# Altium project ETRX_Shield.PrjPcb (part 2 of 3)

## Sheet [2] MCU.SchDoc
size A4; DocumentNumber: 3; SheetNumber: 3; SheetTotal: 4
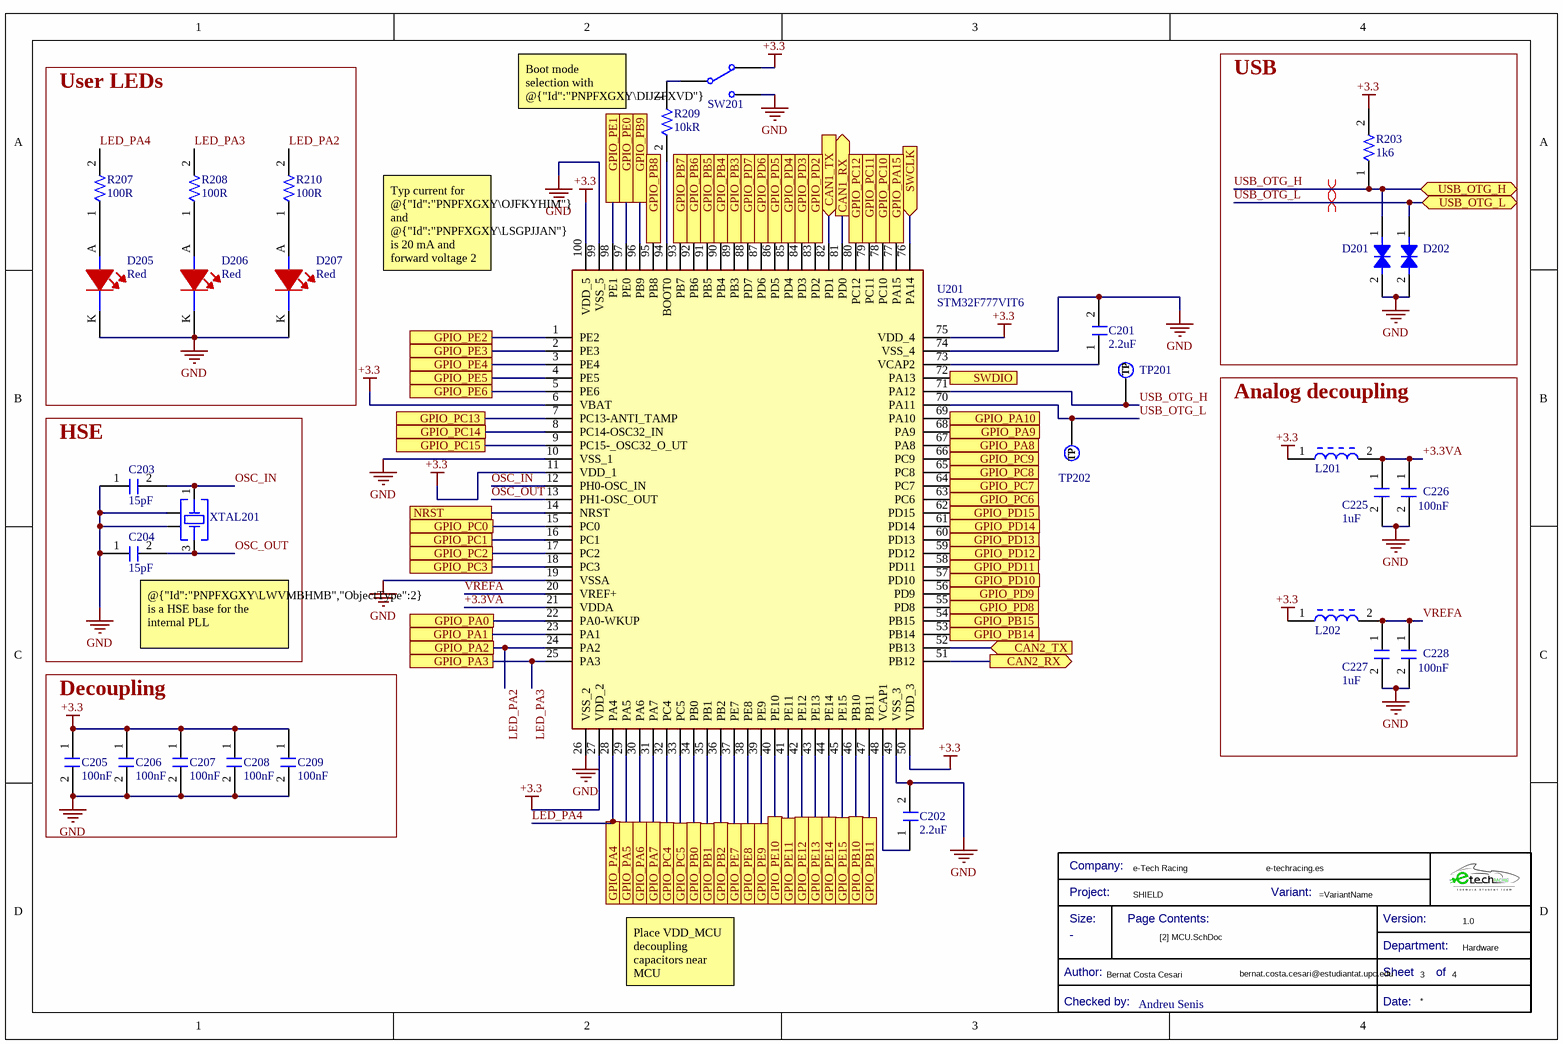
[diagram p2: [2] MCU.SchDoc]

### Parts
(Parts that share a designator on the sheet are numbered #1, #2 ... from top to bottom, then left to right.)
*?#2  Checked by:: Andreu Senis  (hidden comment: Title Block_template)  (graphical)
C201  2.2uF  [C0805FNPC-W]
C202  2.2uF  [C0805FNPC-W]
C203  Capacitance: 15pF  [C0805FNPC-R]  (hidden comment: 885012007052)
C204  Capacitance: 15pF  [C0805FNPC-R]  (hidden comment: 885012007052)
C205  Capacitance: 100nF  [C0805FNPC-R]  (hidden comment: 885012207098)
C206  Capacitance: 100nF  [C0805FNPC-R]  (hidden comment: 885012207098)
C207  Capacitance: 100nF  [C0805FNPC-R]  (hidden comment: 885012207098)
C208  Capacitance: 100nF  [C0805FNPC-R]  (hidden comment: 885012207098)
C209  Capacitance: 100nF  [C0805FNPC-R]  (hidden comment: 885012207098)
C225  Capacitance: 1uF  [C0805FNPC-R]  (hidden comment: 885012207103)
C226  Capacitance: 100nF  [C0805FNPC-R]  (hidden comment: 885012207098)
C227  Capacitance: 1uF  [C0805FNPC-R]  (hidden comment: 885012207103)
C228  Capacitance: 100nF  [C0805FNPC-R]  (hidden comment: 885012207098)
D201  824501600  [DTVS-DO-214AC]  (value not drawn)
D202  824501600  [DTVS-DO-214AC]  (value not drawn)
D205  Color: Red  [LED_0805_WE]  (hidden comment: 150080RS75000)
D206  Color: Red  [LED_0805_WE]  (hidden comment: 150080RS75000)
D207  Color: Red  [LED_0805_WE]  (hidden comment: 150080RS75000)
L201  782853561  [L_Ferrite_bead_0805]  (value not drawn)
L202  782853561  [L_Ferrite_bead_0805]  (value not drawn)
R203  Resistance: 1k6  [R1206FTK-W]  (hidden comment: CRCW12061K60FKEA)
R207  Resistance: 100R  [R0805FTK]  (hidden comment: CR0805-FX-1000ELF)
R208  Resistance: 100R  [R0805FTK]  (hidden comment: CR0805-FX-1000ELF)
R209  Resistance: 10kR  [R0805FTK]  (hidden comment: CR0805-JW-103ELF)
R210  Resistance: 100R  [R0805FTK]  (hidden comment: CR0805-FX-1000ELF)
SW201  450405020524  [450405020524]  (value not drawn)
TP201  TestPoint  [TestPoint]  (value not drawn)  (no BOM)
TP202  TestPoint  [TestPoint]  (value not drawn)  (no BOM)
U201  STM32F777VIT6  [QFP50P1600X1600X160-100N]
XTAL201  20MHz  [XTAL_CFPX-104_5_3.2]  (value not drawn)

### Blocks framed on the sheet
User LEDs: D205-D207 R207 R208 R210
USB: D201 D202 R203
HSE: C203 C204 XTAL201
Analog decoupling: C225-C228 L201 L202
Decoupling: C205-C209

### Ports
CAN1_RX (out), CAN1_TX (in), CAN2_RX (out), CAN2_TX (in), GPIO_PA0, GPIO_PA1, GPIO_PA2, GPIO_PA3, GPIO_PA4, GPIO_PA5, GPIO_PA6, GPIO_PA7, GPIO_PA8, GPIO_PA9, GPIO_PA10, GPIO_PA15, GPIO_PB0, GPIO_PB1, GPIO_PB2, GPIO_PB3, GPIO_PB4, GPIO_PB5, GPIO_PB6, GPIO_PB7, GPIO_PB8, GPIO_PB9, GPIO_PB10, GPIO_PB11, GPIO_PB14, GPIO_PB15, GPIO_PC0, GPIO_PC1, GPIO_PC2, GPIO_PC3, GPIO_PC4, GPIO_PC5, GPIO_PC6, GPIO_PC7, GPIO_PC8, GPIO_PC9, GPIO_PC10, GPIO_PC11, GPIO_PC12, GPIO_PC13, GPIO_PC14, GPIO_PC15, GPIO_PD2, GPIO_PD3, GPIO_PD4, GPIO_PD5, GPIO_PD6, GPIO_PD7, GPIO_PD8, GPIO_PD9, GPIO_PD10, GPIO_PD11, GPIO_PD12, GPIO_PD13, GPIO_PD14, GPIO_PD15, GPIO_PE0, GPIO_PE1, GPIO_PE2, GPIO_PE3, GPIO_PE4, GPIO_PE5, GPIO_PE6, GPIO_PE7, GPIO_PE8, GPIO_PE9, GPIO_PE10, GPIO_PE11, GPIO_PE12, GPIO_PE13, GPIO_PE14, GPIO_PE15, NRST, SWCLK (in), SWDIO (in), USB_OTG_H (bidir), USB_OTG_L (bidir)

### Nets
+3.3: C205.1 C206.1 C207.1 C208.1 C209.1 L201.1 L202.1 R203.2 SW201.L1 U201.6(VBAT) U201.11(VDD_1) U201.27(VDD_2) U201.50(VDD_3) U201.75(VDD_4) U201.100(VDD_5)
GND: C201.2 C202.2 C203.1 C204.1 C205.2 C206.2 C207.2 C208.2 C209.2 C225.2 C226.2 C227.2 C228.2 D201.2 D202.2 D205.K D206.K D207.K SW201.L2 U201.10(VSS_1) U201.19(VSSA) U201.26(VSS_2) U201.49(VSS_3) U201.74(VSS_4) U201.99(VSS_5) XTAL201.2(GND_&_Lid) XTAL201.4(GND_&_Lid)
+3.3VA: C225.1 C226.1 L201.2 U201.21(VDDA)
CAN1_RX: U201.81(PD0) ; port CAN1_RX
CAN1_TX: U201.82(PD1) ; port CAN1_TX
CAN2_RX: U201.51(PB12) ; port CAN2_RX
CAN2_TX: U201.52(PB13) ; port CAN2_TX
LED_PA2: R210.2 U201.24(PA2) ; port GPIO_PA2
LED_PA3: R208.2 U201.25(PA3) ; port GPIO_PA3
LED_PA4: R207.2 U201.28(PA4) ; port GPIO_PA4
NRST: U201.14(NRST) ; port NRST
OSC_IN: C203.2 U201.12(PH0-OSC_IN) XTAL201.1(Crystal)
OSC_OUT: C204.2 U201.13(PH1-OSC_OUT) XTAL201.3(Crystal)
PA0: U201.22(PA0-WKUP) ; port GPIO_PA0
PA1: U201.23(PA1) ; port GPIO_PA1
PA5: U201.29(PA5) ; port GPIO_PA5
PA6: U201.30(PA6) ; port GPIO_PA6
PA7: U201.31(PA7) ; port GPIO_PA7
PA8: U201.67(PA8) ; port GPIO_PA8
PA9: U201.68(PA9) ; port GPIO_PA9
PA10: U201.69(PA10) ; port GPIO_PA10
PA15: U201.77(PA15) ; port GPIO_PA15
PB0: U201.34(PB0) ; port GPIO_PB0
PB1: U201.35(PB1) ; port GPIO_PB1
PB2: U201.36(PB2) ; port GPIO_PB2
PB3: U201.89(PB3) ; port GPIO_PB3
PB4: U201.90(PB4) ; port GPIO_PB4
PB5: U201.91(PB5) ; port GPIO_PB5
PB6: U201.92(PB6) ; port GPIO_PB6
PB7: U201.93(PB7) ; port GPIO_PB7
PB8: U201.95(PB8) ; port GPIO_PB8
PB9: U201.96(PB9) ; port GPIO_PB9
PB10: U201.46(PB10) ; port GPIO_PB10
PB11: U201.47(PB11) ; port GPIO_PB11
PB14: U201.53(PB14) ; port GPIO_PB14
PB15: U201.54(PB15) ; port GPIO_PB15
PC0: U201.15(PC0) ; port GPIO_PC0
PC1: U201.16(PC1) ; port GPIO_PC1
PC2: U201.17(PC2) ; port GPIO_PC2
PC3: U201.18(PC3) ; port GPIO_PC3
PC4: U201.32(PC4) ; port GPIO_PC4
PC5: U201.33(PC5) ; port GPIO_PC5
PC6: U201.63(PC6) ; port GPIO_PC6
PC7: U201.64(PC7) ; port GPIO_PC7
PC8: U201.65(PC8) ; port GPIO_PC8
PC9: U201.66(PC9) ; port GPIO_PC9
PC10: U201.78(PC10) ; port GPIO_PC10
PC11: U201.79(PC11) ; port GPIO_PC11
PC12: U201.80(PC12) ; port GPIO_PC12
PC13: U201.7(PC13-ANTI_TAMP) ; port GPIO_PC13
PC14: U201.8(PC14-OSC32_IN) ; port GPIO_PC14
PC15: U201.9(PC15-_OSC32_O_UT) ; port GPIO_PC15
PD2: U201.83(PD2) ; port GPIO_PD2
PD3: U201.84(PD3) ; port GPIO_PD3
PD4: U201.85(PD4) ; port GPIO_PD4
PD5: U201.86(PD5) ; port GPIO_PD5
PD6: U201.87(PD6) ; port GPIO_PD6
PD7: U201.88(PD7) ; port GPIO_PD7
PD8: U201.55(PD8) ; port GPIO_PD8
PD9: U201.56(PD9) ; port GPIO_PD9
PD10: U201.57(PD10) ; port GPIO_PD10
PD11: U201.58(PD11) ; port GPIO_PD11
PD12: U201.59(PD12) ; port GPIO_PD12
PD13: U201.60(PD13) ; port GPIO_PD13
PD14: U201.61(PD14) ; port GPIO_PD14
PD15: U201.62(PD15) ; port GPIO_PD15
PE0: U201.97(PE0) ; port GPIO_PE0
PE1: U201.98(PE1) ; port GPIO_PE1
PE2: U201.1(PE2) ; port GPIO_PE2
PE3: U201.2(PE3) ; port GPIO_PE3
PE4: U201.3(PE4) ; port GPIO_PE4
PE5: U201.4(PE5) ; port GPIO_PE5
PE6: U201.5(PE6) ; port GPIO_PE6
PE7: U201.37(PE7) ; port GPIO_PE7
PE8: U201.38(PE8) ; port GPIO_PE8
PE9: U201.39(PE9) ; port GPIO_PE9
PE10: U201.40(PE10) ; port GPIO_PE10
PE11: U201.41(PE11) ; port GPIO_PE11
PE12: U201.42(PE12) ; port GPIO_PE12
PE13: U201.43(PE13) ; port GPIO_PE13
PE14: U201.44(PE14) ; port GPIO_PE14
PE15: U201.45(PE15) ; port GPIO_PE15
SWCLK: U201.76(PA14) ; port SWCLK
SWDIO: U201.72(PA13) ; port SWDIO
USB_OTG_H: D201.1 R203.1 TP201.1(TP) U201.71(PA12) ; port USB_OTG_H
USB_OTG_L: D202.1 TP202.1(TP) U201.70(PA11) ; port USB_OTG_L
VREFA: C227.1 C228.1 L202.2 U201.20(VREF+)
NetC201_1: C201.1 U201.73(VCAP2)
NetC202_1: C202.1 U201.48(VCAP1)
NetD205_A: D205.A R207.1
NetD206_A: D206.A R208.1
NetD207_A: D207.A R210.1
NetR209_1: R209.1 SW201.COM
NetR209_2: R209.2 U201.94(BOOT0)

### Layout directives
differential pair: USB_OTG_H, USB_OTG_L

### Notes on the sheet
- (near R209) Boot mode selection with @{"Id":"PNPFXGXY\DIJZFXVD"}
- Typ current for @{"Id":"PNPFXGXY\OJFKYHIM"} and @{"Id":"PNPFXGXY\LSGPJJAN"} is 20 mA and forward voltage 2 V. R=(3,3-2)/20m
- @{"Id":"PNPFXGXY\LWVMBHMB","ObjectType":2} is a HSE base for the internal PLL
- Place VDD_MCU decoupling capacitors near MCU
- (in symbol Title Block_template) Company:; Project:; Variant:; Size:; Page Contents:; Version:; Department:; Author:; Sheet; of; Checked by:; Date:

### Library data of the parts
*?#2 = Title Block_template: Standard Title Block; .Creator: GP; Category: Title Block; .PCBcheck: GP; .SCHcheck: GP; Size: -
C201 C202 = C2.2u-16V-0805FTK
C203 C204 = C15p-50V-0805FNPC-NP0: Cap, 15PF, 50V, 5%, C0G/NP0, 0805; Manufacturer 1: Wurth Electronics; .Creator: DR; Supplier 1: Newark; Manufacturer Part Number 1: 885012007052; RoHS: Yes; Category: Ceramic Capacitors; Stock 1: 815; Pricing 1: 1=0,10800, 10=0,05200, 25=0,05100, 50=0,04900, 100=0,04800, 250=0,04600, 500=0,04300 (USD); Mount: Surface Mount; Case/Package: 0805; Case Code (Metric): 2012; Case Code (Imperial): 0805; Min Operating Temperature: -55°C; Max Operating Temperature: 125°C; Packaging: Cut Tape; Voltage Rating: 50V; Tolerance: 5%; Length: 0.079inch; Width: 0.049inch; Thickness: 0.028inch; RoHS Compliant: Yes; ComponentLink1URL: http://www.farnell.com/datasheets/2031702.pdf?src-supplier=Farnell; ComponentLink1Description: http://www.farnell.com/datasheets/2031702.pdf?src-supplier=Farnell; ComponentLink2URL: http://katalog.we-online.de/pbs/datasheet/885012007052.pdf?src-supplier=Digi-Key; ComponentLink2Description: http://katalog.we-online.de/pbs/datasheet/885012007052.pdf?src-supplier=Digi-Key; ComponentLink3URL: https://katalog.we-online.de/pbs/datasheet/885012007052.pdf?src-supplier=Digi-Key; ComponentLink3Description: https://katalog.we-online.de/pbs/datasheet/885012007052.pdf?src-supplier=Digi-Key; Supplier Part Number 1: 15AC9316
C205-C209 C226 C228 = C100n-50V-0805FNPC-X7R: Cap, 0.1ΜF, 50V, 10%, X7R, 0805; Manufacturer 1: Wurth Electronics; .Creator: DR; Supplier 1: RSComponents; Manufacturer Part Number 1: 885012207098; RoHS: Yes; Category: Ceramic Capacitors; Stock 1: 8000; Pricing 1: 100=0,10200, 500=0,07100, 2000=0,06100 (GBP); Mount: Surface Mount; Case/Package: 0805; Case Code (Metric): 2012; Case Code (Imperial): 0805; Min Operating Temperature: -55°C; Max Operating Temperature: 125°C; Packaging: Cut Tape; Voltage Rating: 50V; Dielectric: X7R; Tolerance: 10%; Voltage Rating (DC): 50V; Length: 0.079inch; Width: 0.049inch; Thickness: 0.035inch; REACH SVHC: Unknown; RoHS Compliant: Yes; ComponentLink1URL: http://www.farnell.com/datasheets/1958498.pdf?src-supplier=Farnell; ComponentLink1Description: http://www.farnell.com/datasheets/1958498.pdf?src-supplier=Farnell; ComponentLink2URL: http://www.farnell.com/datasheets/1958498.pdf?src-supplier=Element14; ComponentLink2Description: http://www.farnell.com/datasheets/1958498.pdf?src-supplier=Element14; ComponentLink3URL: https://katalog.we-online.de/pbs/datasheet/885012207098.pdf?src-supplier=Digi-Key; ComponentLink3Description: https://katalog.we-online.de/pbs/datasheet/885012207098.pdf?src-supplier=Digi-Key; ComponentLink4URL: http://www.farnell.com/datasheets/1958498.pdf?src-supplier=Newark; ComponentLink4Description: http://www.farnell.com/datasheets/1958498.pdf?src-supplier=Newark; Supplier Part Number 1: 1813493
C225 C227 = C1u-50V-0805FNPC-X7R: Multilayer Ceramic Capacitor, Wcap-Csgp Series, 1 F, 10%, X7R, 50 V, 0805 [2012 Metric] Rohs Compliant: Yes; Manufacturer 1: Wurth Electronics; Voltage Rating: 50V; .Creator: GP; Supplier 1: RSComponents; Manufacturer Part Number 1: 885012207103; RoHS: Yes; Category: Ceramic Capacitors; Stock 1: 5100; Pricing 1: 50=0,27200, 250=0,25300, 500=0,22800, 1250=0,20100, 2500=0,17100 (GBP); Mount: Surface Mount; Case/Package: 0805; Case Code (Metric): 2012; Case Code (Imperial): 0805; Min Operating Temperature: -55°C; Max Operating Temperature: 85°C; Packaging: Cut Tape; Dielectric: X7R; Tolerance: 10%; Voltage Rating (DC): 50V; Length: 0.079inch; Width: 0.049inch; Thickness: 0.053inch; REACH SVHC: Unknown; RoHS Compliant: Yes; ComponentLink1URL: http://www.farnell.com/datasheets/1958501.pdf?src-supplier=Farnell; ComponentLink1Description: http://www.farnell.com/datasheets/1958501.pdf?src-supplier=Farnell; ComponentLink2URL: http://www.farnell.com/datasheets/1958501.pdf?src-supplier=Element14; ComponentLink2Description: http://www.farnell.com/datasheets/1958501.pdf?src-supplier=Element14; ComponentLink3URL: https://katalog.we-online.de/pbs/datasheet/885012107003.pdf?src-supplier=Digi-Key; ComponentLink3Description: https://katalog.we-online.de/pbs/datasheet/885012107003.pdf?src-supplier=Digi-Key; ComponentLink4URL: http://www.farnell.com/datasheets/1958501.pdf?src-supplier=Newark; ComponentLink4Description: http://www.farnell.com/datasheets/1958501.pdf?src-supplier=Newark; Supplier Part Number 1: 1813523
D201 D202 = DTVS-6V-DO-214AC: TVS diode [Würth Elektronik] 824501600 TVS diode; Manufacturer: Wurth Electronics; Number of Bidirectional Channels: 1; Reverse Standoff Voltage: 6V; Min Breakdown Voltage: 7.02V; Clamping Voltage: 10.3V; Peak Pulse Power: 400W; Power Line Protection: No; Polarity: Bidirectional; Peak Pulse Current: 38.8A; .Creator: DO; ComponentLink1Description: Where buy it; ComponentLink1URL: https://www.we-online.com/catalog/en/WE-TVSP?sq=824501600#824501600; Supplier 1: Mouser; Manufacturer Part Number: 824501600; RoHS: Yes; Category: TVS Diodes; Stock 1: 780; Pricing 1: 1=0,28000, 10=0,26100, 50=0,26100, 100=0,23400, 500=0,20400, 1000=0,17400, 10000=0,17400 (USD); Mount: Surface Mount; Number of Pins: 2; Min Operating Temperature: -65°C; Max Operating Temperature: 150°C; Packaging: Cut Tape; Max Breakdown Voltage: 7.02V; Resistor Type: Zener; REACH SVHC: Unknown; RoHS Compliant: Yes; ComponentLink2URL: http://www.farnell.com/datasheets/2036401.pdf?src-supplier=Element14; ComponentLink2Description: http://www.farnell.com/datasheets/2036401.pdf?src-supplier=Element14; Supplier Part Number 1: 710-824501600; ComponentLink3URL: https://katalog.we-online.de/pbs/datasheet/824501600.pdf?src-supplier=Digi-Key; ComponentLink3Description: https://katalog.we-online.de/pbs/datasheet/824501600.pdf?src-supplier=Digi-Key
D205-D207 = LEDRS-0805-150: 0805(H=0.8mm) 红色 高亮 λD=625nm VF=2V IF=30mA PD=72mW; Manufacturer 1: Wurth Electronics; Luminous Intensity: 150mcd; Viewing Angle: 140°; Forward Voltage: 2V; Wavelength: 625nm; Lens Style: Clear,Rectangular; Forward Current: 30mA; Test Current: 20mA; .Creator: DR; ComponentLink1Description: Datasheet; ComponentLink1URL: https://www.we-online.com/catalog/datasheet/150080RS75000.pdf; ComponentLink2Description: Where buy it; ComponentLink2URL: https://katalog.we-online.de/en/led/WL-SMCW/150080RS75000; Supplier 1: RSComponents; Manufacturer Part Number 1: 150080RS75000; RoHS: Yes; Category: LEDs; Stock 1: 1; Pricing 1: 50=0,19300, 500=0,12900, 1000=0,12300, 2000=0,11700, 4000=0,11100 (USD); Mount: Surface Mount; Case/Package: 0805; Case Code (Metric): 2012; Case Code (Imperial): 0805; Min Operating Temperature: -40°C; Max Operating Temperature: 85°C; Package Quantity: 4000; Packaging: Tape and Reel; Dominant Wavelength: 625nm; Length: 2mm; Width: 1.25mm; Height: 0.7mm; REACH SVHC: Unknown; RoHS Compliant: Yes; ComponentLink3URL: https://datasheet.ciiva.com/22656/150080rs75000-22656961.pdf?src-supplier=Element14; ComponentLink3Description: https://datasheet.ciiva.com/22656/150080rs75000-22656961.pdf?src-supplier=Element14; ComponentLink4URL: https://datasheet.ciiva.com/29279/759435-da-01-en-chipled-0805-w-kl-rot-150080rs75000-29279032.pdf?src-supplier=Conrad; ComponentLink4Description: https://datasheet.ciiva.com/29279/759435-da-01-en-chipled-0805-w-kl-rot-150080rs75000-29279032.pdf?src-supplier=Conrad; Supplier Part Number 1: 8154225P
L201 L202 = L_Ferrite_bead_782853561: Manufacturer: Murata; Manufacturer Part Number: BLM18EG331TN1D; Material: Ferrite,Steel; Impedance: 330R; DC Resistance (DCR): 210mR; Tolerance: 25%; Current Rating: 500mA; Number of Lines: 1; Test Frequency: 100MHz; .Creator: GP; Supplier 1: Digi-Key; RoHS: Yes; Category: Ferrite Beads and Chips; Stock 1: 20037; Pricing 1: 1=0,23000, 10=0,17500, 25=0,14520, 50=0,12520, 100=0,11260, 250=0,09508, 500=0,08508, 1000=0,07257 (USD); Case/Package: 0603; Number of Pins: 2; Core Material: Ferrite; Case Code (Metric): 1608; Case Code (Imperial): 0603; Min Operating Temperature: -55°C; Max Operating Temperature: 125°C; Packaging: Tape and Reel; Max DC Current: 500mA; Number of Circuits: 1; Package Quantity: 1; Max Current Rating: 500mA; Termination: SMD/SMT; Series: BLM18E; Resistance: 210mR; Length: 1.6mm; Width: 0.8mm; Height: 0.8mm; Depth: 0.8mm; REACH SVHC: No SVHC; Lead Free: Lead Free; RoHS Compliant: Yes; ComponentLink1URL: https://datasheet.ciiva.com/1467/5169-1467232.pdf?src-supplier=Element14; ComponentLink1Description: https://datasheet.ciiva.com/1467/5169-1467232.pdf?src-supplier=Element14; ComponentLink2URL: https://datasheet.ciiva.com/11795/0900766b811b5866-11795405.pdf?src-supplier=RSComponents; ComponentLink2Description: https://datasheet.ciiva.com/11795/0900766b811b5866-11795405.pdf?src-supplier=RSComponents; ComponentLink3URL: https://datasheet.ciiva.com/41449/001172267-da-01-en-drossel-0603-330r-1-6x0-8mm-4000st-41449581.pdf?src-supplier=Conrad; ComponentLink3Description: https://datasheet.ciiva.com/41449/001172267-da-01-en-drossel-0603-330r-1-6x0-8mm-4000st-41449581.pdf?src-supplier=Conrad; ComponentLink4URL: https://datasheet.ciiva.com/1467/5169-1467233.pdf?src-supplier=Element14; ComponentLink4Description: https://datasheet.ciiva.com/1467/5169-1467233.pdf?src-supplier=Element14; ComponentLink5URL: https://datasheet.ciiva.com/1561/5169-1561345.pdf?src-supplier=Newark; ComponentLink5Description: https://datasheet.ciiva.com/1561/5169-1561345.pdf?src-supplier=Newark; ComponentLink6URL: https://datasheet.ciiva.com/3082/l0110s0101blm18e-3082714.pdf?src-supplier=Avnet; ComponentLink6Description: https://datasheet.ciiva.com/3082/l0110s0101blm18e-3082714.pdf?src-supplier=Avnet; ComponentLink7URL: https://datasheet.ciiva.com/6211/l0110s0101blm18e-6211470.pdf?src-supplier=Digi-Key; ComponentLink7Description: https://datasheet.ciiva.com/6211/l0110s0101blm18e-6211470.pdf?src-supplier=Digi-Key; ComponentLink8URL: https://datasheet.ciiva.com/6211/l0110s0101blm18e-6211471.pdf?src-supplier=Digi-Key; ComponentLink8Description: https://datasheet.ciiva.com/6211/l0110s0101blm18e-6211471.pdf?src-supplier=Digi-Key; Supplier Part Number 1: 490-5913-1-ND
R203 = R1.6K-1206FTK: Res Thick Film 1206 1.6K Ohm 1% 1/4W ±100ppm/°C Molded SMD SMD Paper T/R; Manufacturer 1: Vishay; Max Power Dissipation: 250mW; Voltage Rating: 200V; .Creator: DO; Supplier 1: Digi-Key; Manufacturer Part Number 1: CRCW12061K60FKEA; RoHS: Yes; Category: Chip SMD Resistors; Pricing 1: 1=0,10000, 10=0,08200, 100=0,03160, 1000=0,01392, 2500=0,01202 (USD); Case/Package: 1206; Number of Pins: 2; Contact Plating: Tin; Case Code (Metric): 3216; Case Code (Imperial): 1206; Weight: 0.000353oz; Size Code: 1206; Min Operating Temperature: -55°C; Max Operating Temperature: 155°C; Tolerance: 1%; Resistor Type: Thick Film; Temperature Coefficient: 100ppm/°C; Package Quantity: 5000; Packaging: Tape and Reel; Number of Terminations: 2; Features: Automotive AEC-Q200; Series: CRCW; Power Rating: 250mW; Termination: SMD/SMT; Voltage Rating (DC): 200V; Resistance Tolerance: 1%; Technology: THICK FILM; Construction: Rectangular; Length: 3.2mm; Width: 0.063inch; Height: 0.55mm; Depth: 1.6mm; Radiation Hardening: No; Lead Free: Lead Free; RoHS Compliant: Yes; REACH SVHC: Unknown; Military Standard: Not; ComponentLink1URL: https://datasheet.ciiva.com/11811/0900766b80d98b5e-11811377.pdf?src-supplier=RSComponents; ComponentLink1Description: https://datasheet.ciiva.com/11811/0900766b80d98b5e-11811377.pdf?src-supplier=RSComponents; ComponentLink2URL: https://datasheet.ciiva.com/2515/dcrcwe3-2515616.pdf?src-supplier=Digi-Key; ComponentLink2Description: https://datasheet.ciiva.com/2515/dcrcwe3-2515616.pdf?src-supplier=Digi-Key; ComponentLink3URL: https://datasheet.ciiva.com/2515/dcrcwe3-2515617.pdf?src-supplier=Digi-Key; ComponentLink3Description: https://datasheet.ciiva.com/2515/dcrcwe3-2515617.pdf?src-supplier=Digi-Key; ComponentLink4URL: https://datasheet.ciiva.com/2515/dcrcwe3-2515618.pdf?src-supplier=Digi-Key; ComponentLink4Description: https://datasheet.ciiva.com/2515/dcrcwe3-2515618.pdf?src-supplier=Digi-Key; ComponentLink5URL: https://datasheet.ciiva.com/9098/dcrcwe3-9098889.pdf?src-supplier=Avnet; ComponentLink5Description: https://datasheet.ciiva.com/9098/dcrcwe3-9098889.pdf?src-supplier=Avnet; ComponentLink6URL: https://datasheet.ciiva.com/16213/dcrcwe3-16213498.pdf?src-supplier=Future+Electronics; ComponentLink6Description: https://datasheet.ciiva.com/16213/dcrcwe3-16213498.pdf?src-supplier=Future+Electronics; ComponentLink7URL: https://datasheet.ciiva.com/17203/dcrcwe3-17203786.pdf?src-supplier=Avnet+Europe; ComponentLink7Description: https://datasheet.ciiva.com/17203/dcrcwe3-17203786.pdf?src-supplier=Avnet+Europe; ComponentLink8URL: https://datasheet.ciiva.com/7670/1697337-7670316.pdf?src-supplier=Element14; ComponentLink8Description: https://datasheet.ciiva.com/7670/1697337-7670316.pdf?src-supplier=Element14; ComponentLink9URL: https://datasheet.ciiva.com/7670/1697337-7670317.pdf?src-supplier=Element14; ComponentLink9Description: https://datasheet.ciiva.com/7670/1697337-7670317.pdf?src-supplier=Element14; ComponentLink10URL: https://datasheet.ciiva.com/5550/dcrcwe3-109170-5550718.pdf?src-supplier=Mouser; ComponentLink10Description: https://datasheet.ciiva.com/5550/dcrcwe3-109170-5550718.pdf?src-supplier=Mouser; Supplier Part Number 1: 541-1.60KFCT-ND; ComponentLink11Description: RS; ComponentLink11URL: https://es.rs-online.com/web/p/resistencias-fijas-para-montaje-en-superficie/6791866/
R207 R208 R210 = R100-0805FTK: Res Thick Film 0805 100 Ohm 1% 1/8W ±100ppm/°C Molded SMD SMD Paper Tape on Plastic Reel; Manufacturer 1: Bourns; Power Rating: 125mW; Voltage Rating: 150V; .Creator: DR; Supplier 1: Arrow Electronics; Manufacturer Part Number 1: CR0805-FX-1000ELF; RoHS: Yes; Category: Chip SMD Resistors; Stock 1: 49802; Pricing 1: 1=0,05840, 10=0,03430, 25=0,01780, 100=0,00750, 250=0,00560, 500=0,00490, 3000=0,00470 (USD); Mount: Surface Mount; Case/Package: 0805; Number of Pins: 2; Contact Plating: Tin; Case Code (Imperial): 0805; Case Code (Metric): 2012; Min Operating Temperature: -55°C; Max Operating Temperature: 155°C; Tolerance: 1%; Resistor Type: Thick Film; Temperature Coefficient: 100ppm/°C; Packaging: Tape and Reel; Package Quantity: 1; Termination: SMD/SMT; Number of Terminations: 2; Max Power Dissipation: 125mW; Voltage Rating (DC): 150V; Features: Moisture Resistant; Series: CR0805; Resistance Tolerance: 1%; Construction: Rectangular; Technology: THICK FILM; Length: 2mm; Width: 1.25mm; Height: 0.5mm; Depth: 1.25mm; Thickness: 508um; Radiation Hardening: No; REACH SVHC: No SVHC; Military Standard: Not; RoHS Compliant: Yes; ComponentLink1URL: https://datasheet.ciiva.com/11809/0900766b80fcdb72-11809178.pdf?src-supplier=RSComponents; ComponentLink1Description: https://datasheet.ciiva.com/11809/0900766b80fcdb72-11809178.pdf?src-supplier=RSComponents; ComponentLink2URL: https://datasheet.ciiva.com/6547/chpreztr-6547413.pdf?src-supplier=Digi-Key; ComponentLink2Description: https://datasheet.ciiva.com/6547/chpreztr-6547413.pdf?src-supplier=Digi-Key; ComponentLink3URL: https://datasheet.ciiva.com/6547/chpreztr-6547414.pdf?src-supplier=Digi-Key; ComponentLink3Description: https://datasheet.ciiva.com/6547/chpreztr-6547414.pdf?src-supplier=Digi-Key; ComponentLink4URL: https://datasheet.ciiva.com/6547/chpreztr-6547415.pdf?src-supplier=Digi-Key; ComponentLink4Description: https://datasheet.ciiva.com/6547/chpreztr-6547415.pdf?src-supplier=Digi-Key; ComponentLink5URL: https://datasheet.ciiva.com/9120/chpreztr-9120744.pdf?src-supplier=Avnet; ComponentLink5Description: https://datasheet.ciiva.com/9120/chpreztr-9120744.pdf?src-supplier=Avnet; Supplier Part Number 1: CR0805-FX-1000ELF
R209 = R10k-0805FTK: BOURNS         CR0805-JW-103ELF            Surface Mount Chip Resistor, Thick Film, CR Series, 10 kohm, 125 mW,  5%, 150 V; Temperature Coefficient: 200ppm/°C; Power Rating: 125mW; Voltage Rating: 150V; Voltage Rating (DC): 100V; .Creator: DR; Supplier 1: Arrow Electronics; Manufacturer 1: Bourns; Manufacturer Part Number 1: CR0805-JW-103ELF; RoHS: Yes; Category: Chip SMD Resistors; Stock 1: 57566; Pricing 1: 1=0,05790, 10=0,01540, 25=0,01340, 100=0,00340 (USD); Mount: Surface Mount; Case/Package: 0805; Number of Pins: 2; Contact Plating: Tin; Case Code (Metric): 2012; Case Code (Imperial): 0805; Min Operating Temperature: -55°C; Max Operating Temperature: 155°C; Tolerance: 5%; Resistor Type: Thick Film; Package Quantity: 1; Packaging: Tape and Reel; Number of Terminations: 2; Termination: SMD/SMT; Max Power Dissipation: 125mW; Features: Moisture Resistant; Series: CR0805; Construction: Rectangular; Resistance Tolerance: 5%; Technology: THICK FILM; Length: 2mm; Width: 1.25mm; Height: 0.5mm; Depth: 1.25mm; Thickness: 508um; Radiation Hardening: No; REACH SVHC: No SVHC; Military Standard: Not; RoHS Compliant: Yes; ComponentLink1URL: https://datasheet.ciiva.com/11821/0900766b80fcdb72-11821135.pdf?src-supplier=RSComponents; ComponentLink1Description: https://datasheet.ciiva.com/11821/0900766b80fcdb72-11821135.pdf?src-supplier=RSComponents; ComponentLink2URL: https://datasheet.ciiva.com/9122/chpreztr-9122374.pdf?src-supplier=Avnet; ComponentLink2Description: https://datasheet.ciiva.com/9122/chpreztr-9122374.pdf?src-supplier=Avnet; ComponentLink3URL: https://datasheet.ciiva.com/22693/1902866-22693254.pdf?src-supplier=Element14; ComponentLink3Description: https://datasheet.ciiva.com/22693/1902866-22693254.pdf?src-supplier=Element14; ComponentLink4URL: https://datasheet.ciiva.com/7986/691949-7986187.pdf?src-supplier=Element14; ComponentLink4Description: https://datasheet.ciiva.com/7986/691949-7986187.pdf?src-supplier=Element14; ComponentLink5URL: https://datasheet.ciiva.com/30065/159chpreztr-30065976.pdf?src-supplier=Onlinecomponents.com; ComponentLink5Description: https://datasheet.ciiva.com/30065/159chpreztr-30065976.pdf?src-supplier=Onlinecomponents.com; ComponentLink6URL: https://datasheet.ciiva.com/16783/70154685-16783482.pdf?src-supplier=Allied+Electronics; ComponentLink6Description: https://datasheet.ciiva.com/16783/70154685-16783482.pdf?src-supplier=Allied+Electronics; ComponentLink7URL: https://datasheet.ciiva.com/5548/chpreztr-5548491.pdf?src-supplier=Mouser; ComponentLink7Description: https://datasheet.ciiva.com/5548/chpreztr-5548491.pdf?src-supplier=Mouser; ComponentLink8URL: https://datasheet.ciiva.com/6559/chpreztr-6559900.pdf?src-supplier=Digi-Key; ComponentLink8Description: https://datasheet.ciiva.com/6559/chpreztr-6559900.pdf?src-supplier=Digi-Key; ComponentLink9URL: https://datasheet.ciiva.com/6559/chpreztr-6559901.pdf?src-supplier=Digi-Key; ComponentLink9Description: https://datasheet.ciiva.com/6559/chpreztr-6559901.pdf?src-supplier=Digi-Key; ComponentLink10URL: https://datasheet.ciiva.com/7985/1856384-7985869.pdf?src-supplier=Element14; ComponentLink10Description: https://datasheet.ciiva.com/7985/1856384-7985869.pdf?src-supplier=Element14; ComponentLink11URL: https://datasheet.ciiva.com/48692/001055517-da-01-en-smd-wid-cr0805-jw-103elf-10k-ohm-1-8w-48692118.pdf?src-supplier=Conrad; ComponentLink11Description: https://datasheet.ciiva.com/48692/001055517-da-01-en-smd-wid-cr0805-jw-103elf-10k-ohm-1-8w-48692118.pdf?src-supplier=Conrad; Supplier Part Number 1: CR0805-JW-103ELF
SW201 = 450405020524: WS-SLSU SMT Mini Slide Switch Same Side Connection, SPDT, 5VDC, 300mA, 225g; Manufacturer: Wurth Elektronik; ComponentLink1Description: Website Link; ComponentLink1URL: https://www.we-online.com/redexpert/article/450405020524?ad; ComponentLink2Description: Datasheet Link; ComponentLink2URL: https://www.we-online.com/redexpert/spec/450405020524?ad; Manufacturer Part Number: 450405020524; Category: Slide Switches; Match Code: WS-SLSU; Mount: Surface Mount; Operating Temperature Max: 85°C; Operating Temperature Min: -40°C; Packaging: Tape and Reel; Length: 8.7mm; Width: 3mm; Height: 2mm; Circuit: SPDT; Contact Material: Copper Alloy; Contact Plating: Silver; Operation Force: 225g; Rated Current: 300mA; Rated Voltage: 5VDC; Terminal Material: Copper Alloy; Terminal Plating: Silver
TP201 TP202 = TestPoint: Test Point 1x1 mm; .Creator: GP; Category: TestPoint; .PCBcheck: GP; .SCHcheck: GP
U201 = STM32F777VIT6: ARM Microcontrollers - MCU 16/32-BITS MICROS; Manufacturer_Name: STMicroelectronics; Geometry.Height: 1.6mm; Mouser Part Number: 511-STM32F777VIT6; Mouser Price/Stock: https://www.mouser.co.uk/ProductDetail/STMicroelectronics/STM32F777VIT6?qs=qzCNEk%252BRr%252BbclRoyC9pexg%3D%3D; Manufacturer_Part_Number: STM32F777VIT6; Datasheet Link: https://www.st.com/resource/en/datasheet/stm32f777vi.pdf
XTAL201 = XTAL_CPFX104_5_3.2: WE-XTAL Quartz Crystal, SMT, CFPX-104, 20MHz, +/-20ppm; Manufacturer Part Number: 830056808; Manufacturer: Wurth Elektronik; Frequency Stability: +/-30ppm; Load Capacitance: 18pF; ComponentLink1Description: Website Link; ComponentLink1URL: https://www.we-online.com/redexpert/article/830056808?ad; ComponentLink2Description: Datasheet Link; ComponentLink2URL: https://www.we-online.com/redexpert/spec/830056808?ad; Category: Crystals; Match Code: WE-XTAL; Mount: Surface Mount; Operating Temperature Max: 85°C; Operating Temperature Min: -40°C; Packaging: Tape and Reel; Case/Size Code: CFPX-104; Length: 5mm; Width: 3.2mm; Height: 1mm; Frequency: 20MHz; Frequency Tolerance: +/-20ppm

## Sheet [3] CAN.SchDoc
size A4; DocumentNumber: 4; SheetNumber: 4; SheetTotal: 4
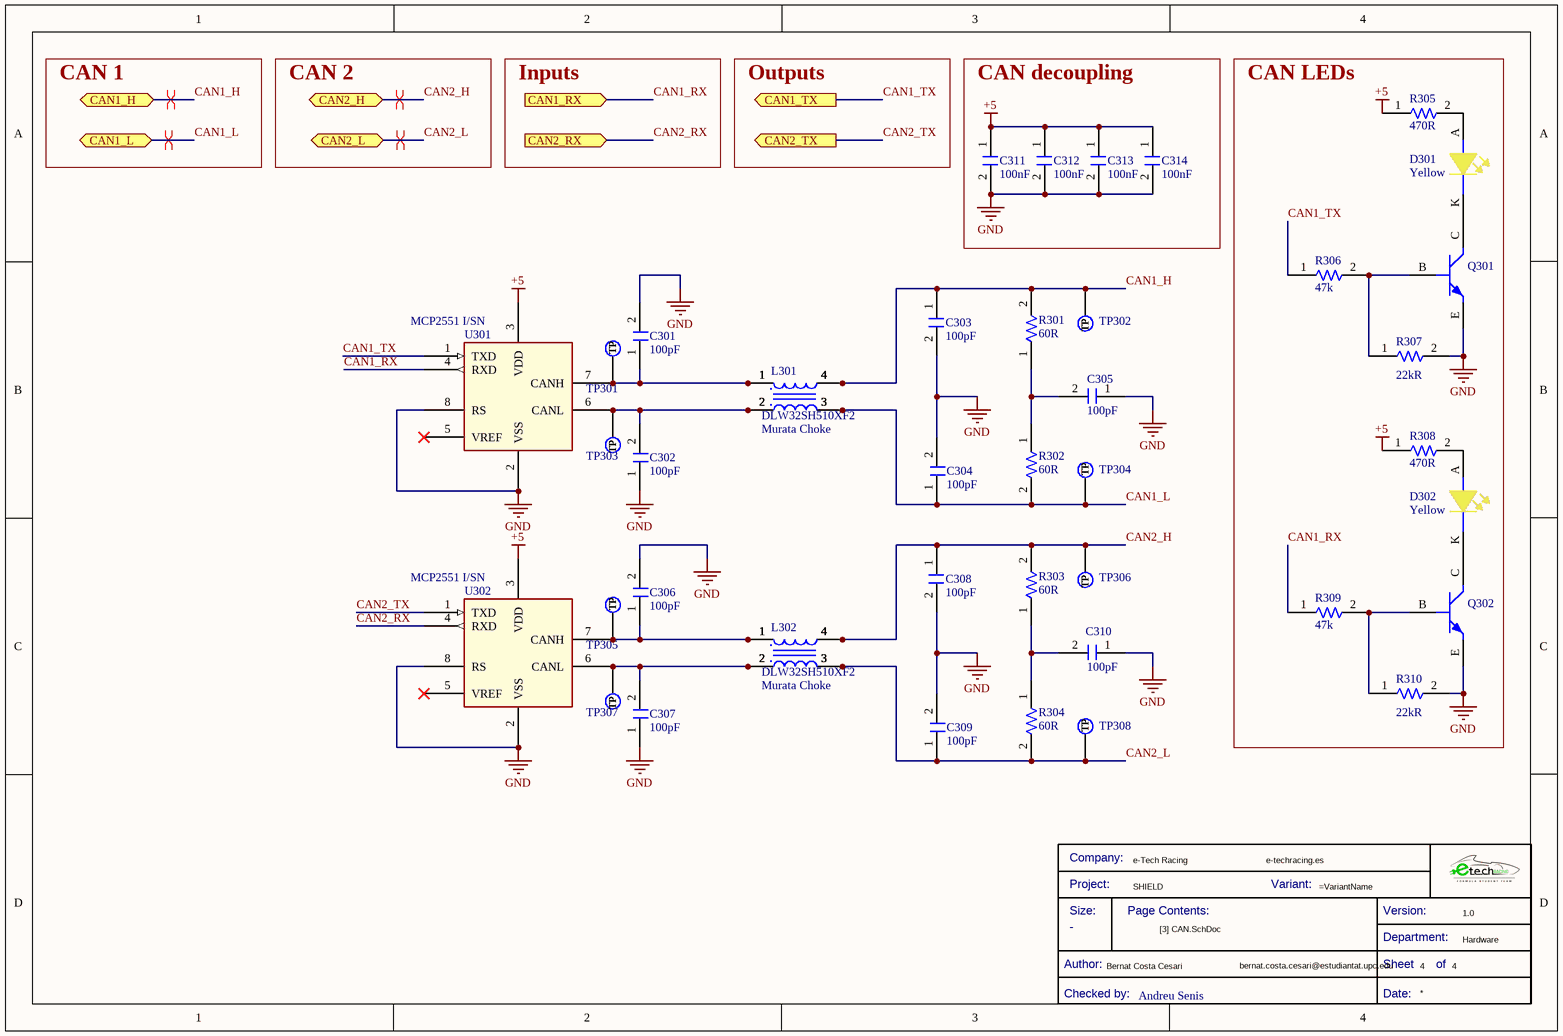
[diagram p3: [3] CAN.SchDoc]

### Parts
(Parts that share a designator on the sheet are numbered #1, #2 ... from top to bottom, then left to right.)
*?#3  Checked by:: Andreu Senis  (hidden comment: Title Block_template)  (graphical)
C301  Capacitance: 100pF  [C0805FNPC-W]  (hidden comment: 885012007057)
C302  Capacitance: 100pF  [C0805FNPC-W]  (hidden comment: 885012007057)
C303  Capacitance: 100pF  [C0805FNPC-W]  (hidden comment: 885012007057)
C304  Capacitance: 100pF  [C0805FNPC-W]  (hidden comment: 885012007057)
C305  Capacitance: 100pF  [C0805FNPC-W]  (hidden comment: 885012007057)
C306  Capacitance: 100pF  [C0805FNPC-W]  (hidden comment: 885012007057)
C307  Capacitance: 100pF  [C0805FNPC-W]  (hidden comment: 885012007057)
C308  Capacitance: 100pF  [C0805FNPC-W]  (hidden comment: 885012007057)
C309  Capacitance: 100pF  [C0805FNPC-W]  (hidden comment: 885012007057)
C310  Capacitance: 100pF  [C0805FNPC-W]  (hidden comment: 885012007057)
C311  Capacitance: 100nF  [C0805FNPC-R]  (hidden comment: 885012207098)
C312  Capacitance: 100nF  [C0805FNPC-R]  (hidden comment: 885012207098)
C313  Capacitance: 100nF  [C0805FNPC-R]  (hidden comment: 885012207098)
C314  Capacitance: 100nF  [C0805FNPC-R]  (hidden comment: 885012207098)
D301  Color: Yellow  [LED_0805_WE]  (hidden comment: 150080YS75000)
D302  Color: Yellow  [LED_0805_WE]  (hidden comment: 150080YS75000)
L301  DLW32SH510XF2
L302  DLW32SH510XF2
Q301  BC817-25LT1G  [TRT-NPN-0.5/45-SOT23]  (value not drawn)
Q302  BC817-25LT1G  [TRT-NPN-0.5/45-SOT23]  (value not drawn)
R301  value 60R  [R0805FTK]  (hidden comment: R60-0805FTN)
R302  value 60R  [R0805FTK]  (hidden comment: R60-0805FTN)
R303  value 60R  [R0805FTK]  (hidden comment: R60-0805FTN)
R304  value 60R  [R0805FTK]  (hidden comment: R60-0805FTN)
R305  Resistance: 470R  [R0805FTK]  (hidden comment: CR0805-FX-4700GLF)
R306  47k
R307  22kR
R308  Resistance: 470R  [R0805FTK]  (hidden comment: CR0805-FX-4700GLF)
R309  47k
R310  22kR
TP301  TestPoint  [TestPoint]  (value not drawn)  (no BOM)
TP302  TestPoint  [TestPoint]  (value not drawn)  (no BOM)
TP303  TestPoint  [TestPoint]  (value not drawn)  (no BOM)
TP304  TestPoint  [TestPoint]  (value not drawn)  (no BOM)
TP305  TestPoint  [TestPoint]  (value not drawn)  (no BOM)
TP306  TestPoint  [TestPoint]  (value not drawn)  (no BOM)
TP307  TestPoint  [TestPoint]  (value not drawn)  (no BOM)
TP308  TestPoint  [TestPoint]  (value not drawn)  (no BOM)
U301  MCP2551 I/SN
U302  MCP2551 I/SN

### Blocks framed on the sheet
CAN decoupling: C311-C314
CAN LEDs: D301 D302 Q301 Q302 R305-R310

### Ports
CAN1_H (bidir), CAN1_L (bidir), CAN1_RX (in), CAN1_TX (out), CAN2_H (bidir), CAN2_L (bidir), CAN2_RX (in), CAN2_TX (out)

### Nets
+5: C311.1 C312.1 C313.1 C314.1 R305.1 R308.1 U301.3(VDD) U302.3(VDD)
GND: C301.2 C302.1 C303.2 C304.2 C305.1 C306.2 C307.1 C308.2 C309.2 C310.1 C311.2 C312.2 C313.2 C314.2 Q301.E Q302.E R307.2 R310.2 U301.2(VSS) U301.8(RS) U302.2(VSS) U302.8(RS)
CAN1_H: C303.1 L301.4(4_OUT) R301.2 TP302.1(TP) ; port CAN1_H
CAN1_L: C304.1 L301.3(3_OUT) R302.2 TP304.1(TP) ; port CAN1_L
CAN1_RX: R309.1 U301.4(RXD) ; port CAN1_RX
CAN1_TX: R306.1 U301.1(TXD) ; port CAN1_TX
CAN2_H: C308.1 L302.4(4_OUT) R303.2 TP306.1(TP) ; port CAN2_H
CAN2_L: C309.1 L302.3(3_OUT) R304.2 TP308.1(TP) ; port CAN2_L
CAN2_RX: U302.4(RXD) ; port CAN2_RX
CAN2_TX: U302.1(TXD) ; port CAN2_TX
NetC301_1: C301.1 L301.1(1_IN) TP301.1(TP) U301.7(CANH)
NetC302_2: C302.2 L301.2(2_IN) TP303.1(TP) U301.6(CANL)
NetC305_2: C305.2 R301.1 R302.1
NetC306_1: C306.1 L302.1(1_IN) TP305.1(TP) U302.7(CANH)
NetC307_2: C307.2 L302.2(2_IN) TP307.1(TP) U302.6(CANL)
NetC310_2: C310.2 R303.1 R304.1
NetD301_A: D301.A R305.2
NetD301_K: D301.K Q301.C
NetD302_A: D302.A R308.2
NetD302_K: D302.K Q302.C
NetQ301_B: Q301.B R306.2 R307.1
NetQ302_B: Q302.B R309.2 R310.1

Not connected (* = marked no-connect by the designer): U301 5(VREF)*; U302 5(VREF)*

### Layout directives
differential pair: CAN1_H, CAN1_L, CAN2_H, CAN2_L

### Notes on the sheet
- CAN 1
- CAN 2
- Inputs
- Outputs
- (near L301) Murata Choke
- (near L302) Murata Choke
- (in symbol Title Block_template) Company:; Project:; Variant:; Size:; Page Contents:; Version:; Department:; Author:; Sheet; of; Checked by:; Date:

### Library data of the parts
*?#3 = Title Block_template: Standard Title Block; .Creator: GP; Category: Title Block; .PCBcheck: GP; .SCHcheck: GP; Size: -
C301-C310 = C100p-50V-0805FNPC-C0G/NP0: Multilayer Ceramic Capacitor, Wcap-Csgp Series, 100 Pf, 5%, C0G / Np0, 50 V, 0805 [2012 Metric] Rohs Compliant: Yes; Manufacturer: Wurth Electronics; Voltage Rating: 50V; .Creator: DR; Supplier 1: RSComponents; Manufacturer Part Number: 885012007057; RoHS: Yes; Category: Ceramic Capacitors; Stock 1: 1; Pricing 1: 4000=0,03900, 12000=0,03800 (USD); Mount: Surface Mount; Case/Package: 0805; Case Code (Metric): 2012; Case Code (Imperial): 0805; Min Operating Temperature: -55°C; Max Operating Temperature: 125°C; Packaging: Cut Tape; Dielectric: C0G; Tolerance: 5%; Voltage Rating (DC): 50V; Length: 0.079inch; Width: 0.049inch; Thickness: 0.035inch; REACH SVHC: Unknown; RoHS Compliant: Yes; ComponentLink1URL: http://www.farnell.com/datasheets/1958443.pdf?src-supplier=Farnell; ComponentLink1Description: http://www.farnell.com/datasheets/1958443.pdf?src-supplier=Farnell; ComponentLink2URL: https://katalog.we-online.de/pbs/datasheet/885012007057.pdf?src-supplier=Digi-Key; ComponentLink2Description: https://katalog.we-online.de/pbs/datasheet/885012007057.pdf?src-supplier=Digi-Key; ComponentLink3URL: http://www.farnell.com/datasheets/1958443.pdf?src-supplier=Element14; ComponentLink3Description: http://www.farnell.com/datasheets/1958443.pdf?src-supplier=Element14; ComponentLink4URL: http://www.farnell.com/datasheets/1958443.pdf?src-supplier=Newark; ComponentLink4Description: http://www.farnell.com/datasheets/1958443.pdf?src-supplier=Newark; ComponentLink5Description: Where buy it; ComponentLink5URL: https://www.we-online.com/catalog/en/WCAP-CSGP-50VDC#885012007057; Supplier Part Number 1: 1813930
C311-C314 = C100n-50V-0805FNPC-X7R: as C205 on sheet [2] MCU; Supplier 1: RSComponents; Manufacturer Part Number 1: 885012207098; RoHS: Yes; Category: Ceramic Capacitors; Stock 1: 8000; Pricing 1: 100=0,10200, 500=0,07100, 2000=0,06100 (GBP); Mount: Surface Mount; Case/Package: 0805; Case Code (Metric): 2012; Case Code (Imperial): 0805; Min Operating Temperature: -55°C; Max Operating Temperature: 125°C; Packaging: Cut Tape; Voltage Rating: 50V; Dielectric: X7R; Tolerance: 10%; Voltage Rating (DC): 50V; Length: 0.079inch; Width: 0.049inch; Thickness: 0.035inch; REACH SVHC: Unknown; RoHS Compliant: Yes; ComponentLink1URL: http://www.farnell.com/datasheets/1958498.pdf?src-supplier=Farnell; ComponentLink1Description: http://www.farnell.com/datasheets/1958498.pdf?src-supplier=Farnell; ComponentLink2URL: http://www.farnell.com/datasheets/1958498.pdf?src-supplier=Element14; ComponentLink2Description: http://www.farnell.com/datasheets/1958498.pdf?src-supplier=Element14; ComponentLink3URL: https://katalog.we-online.de/pbs/datasheet/885012207098.pdf?src-supplier=Digi-Key; ComponentLink3Description: https://katalog.we-online.de/pbs/datasheet/885012207098.pdf?src-supplier=Digi-Key; ComponentLink4URL: http://www.farnell.com/datasheets/1958498.pdf?src-supplier=Newark; ComponentLink4Description: http://www.farnell.com/datasheets/1958498.pdf?src-supplier=Newark; Supplier Part Number 1: 1813493
D301 D302 = LEDYS-0805-120: 2 V Yellow LED 2012 (0805) SMD, Wurth Elektronik WL-SMCW 150080YS75000; Manufacturer 1: Wurth Electronics; Luminous Intensity: 120mcd; Forward Current: 30mA; Forward Voltage: 2V; Viewing Angle: 140°; Wavelength: 590nm; Lens Style: Clear,Rectangular; Test Current: 20mA; .Creator: DR; ComponentLink1Description: Datasheet; ComponentLink1URL: https://www.we-online.com/catalog/datasheet/150080YS75000.pdf; ComponentLink2Description: Where buy it; ComponentLink2URL: https://katalog.we-online.de/en/led/WL-SMCW/150080YS75000; Supplier 1: RSComponents; Manufacturer Part Number 1: 150080YS75000; RoHS: Yes; Category: LEDs; Stock 1: 2100; Pricing 1: 50=0,19300, 500=0,12900, 750=0,12300, 1500=0,11700, 3000=0,11100 (USD); Mount: Surface Mount; Case/Package: 0805; Case Code (Metric): 2012; Case Code (Imperial): 0805; Min Operating Temperature: -40°C; Max Operating Temperature: 85°C; Package Quantity: 4000; Packaging: Tape and Reel; Dominant Wavelength: 590nm; Length: 2mm; Width: 1.25mm; Height: 0.7mm; REACH SVHC: Unknown; RoHS Compliant: Yes; ComponentLink3URL: https://datasheet.ciiva.com/23843/150080ys75000-23843256.pdf?src-supplier=Newark; ComponentLink3Description: https://datasheet.ciiva.com/23843/150080ys75000-23843256.pdf?src-supplier=Newark; ComponentLink4URL: https://datasheet.ciiva.com/29279/759438-da-01-en-chipled-0805-w-kl-gelb-150080ys75000-29279034.pdf?src-supplier=Conrad; ComponentLink4Description: https://datasheet.ciiva.com/29279/759438-da-01-en-chipled-0805-w-kl-gelb-150080ys75000-29279034.pdf?src-supplier=Conrad; ComponentLink5URL: https://datasheet.ciiva.com/22656/1911353-22656971.pdf?src-supplier=Element14; ComponentLink5Description: https://datasheet.ciiva.com/22656/1911353-22656971.pdf?src-supplier=Element14; ComponentLink6URL: https://datasheet.ciiva.com/29563/150080ys75000-29563019.pdf?src-supplier=Digi-Key; ComponentLink6Description: https://datasheet.ciiva.com/29563/150080ys75000-29563019.pdf?src-supplier=Digi-Key; ComponentLink7URL: https://datasheet.ciiva.com/29563/150080ys75000-29563020.pdf?src-supplier=Digi-Key; ComponentLink7Description: https://datasheet.ciiva.com/29563/150080ys75000-29563020.pdf?src-supplier=Digi-Key; ComponentLink8URL: https://datasheet.ciiva.com/29563/150080ys75000-29563021.pdf?src-supplier=Digi-Key; ComponentLink8Description: https://datasheet.ciiva.com/29563/150080ys75000-29563021.pdf?src-supplier=Digi-Key; Supplier Part Number 1: 8154231
L301 L302 = CMC-51uH-125mA: Common Mode Noise Filter for CAN DCMR Class3 Compliance; Supplier 1: Mouser; Supplier Part Number 1: 81-DLW32SH510XF2L; Specifications sheet: https://www.murata.com/products/productdata/8804914298910/QFLC9127.pdf?1681702277000
Q301 Q302 = TRT-NPN-0.5/45-SOT23: ON Semi BC817-25LT1G NPN Bipolar Transistor; 0.5 A; 45 V; 3-Pin SOT-23; Collector Emitter Voltage (VCEO): 45V; Max Collector Current: 500mA; Collector Base Voltage (VCBO): 50V; Power Dissipation: 300mW; hFE Min: 160; Transition Frequency: 100MHz; Emitter Base Voltage (VEBO): 5V; Element Configuration: Single; Collector-emitter Voltage-Max: 700mV; Number of Elements: 1; .Creator: GP; Category: Transistor; ComponentLink1Description: Datasheet; ComponentLink1URL: *; ComponentLink2Description: Where buy it; ComponentLink2URL: *; Package: *; Type: *; Manufacturer: *; Manufacturer part number: *; Supplier: *; Packaging: *; Max operating temperature: *; Min operating temperature: *; Max power dissipation: *; Power rating: *; RoHS: *; Polarity: *; Vce max: *; Ic max: *; Gain: *; Supplier 1: Digi-Key; Pricing 1: 1=0,20000, 10=0,18500, 100=0,10080, 500=0,06204, 1000=0,04229 (USD); Case/Package: SOT-23-3; Number of Pins: 3; Contact Plating: Tin,Matte; Package Quantity: 1; Collector Emitter Breakdown Voltage: 45V; Max Breakdown Voltage: 45V; Max Frequency: 100MHz; Current Rating: 500mA; Series: -; Frequency: 100MHz; Collector Emitter Saturation Voltage: 700mV; Gain Bandwidth Product: 100MHz; Length: 2.9mm; Width: 1.3mm; Height: 0.94mm; Radiation Hardening: No; Lead Free: Lead Free; Halogen Free: Halogen Free; RoHS Compliant: Yes; REACH SVHC: No SVHC; ComponentLink3URL: https://datasheet.ciiva.com/27748/2010413-27748829.pdf?src-supplier=Jameco; ComponentLink3Description: https://datasheet.ciiva.com/27748/2010413-27748829.pdf?src-supplier=Jameco; ComponentLink4URL: https://datasheet.ciiva.com/15138/getdatasheetpartid-38405-15138602.pdf?src-supplier=Verical; ComponentLink4Description: https://datasheet.ciiva.com/15138/getdatasheetpartid-38405-15138602.pdf?src-supplier=Verical; ComponentLink5URL: https://datasheet.ciiva.com/1196/bc817-16lt1-d-1196558.pdf?src-supplier=Element14; ComponentLink5Description: https://datasheet.ciiva.com/1196/bc817-16lt1-d-1196558.pdf?src-supplier=Element14; ComponentLink6URL: https://datasheet.ciiva.com/22641/bc817-16lt1-d-22641013.pdf?src-supplier=Farnell; ComponentLink6Description: https://datasheet.ciiva.com/22641/bc817-16lt1-d-22641013.pdf?src-supplier=Farnell; ComponentLink7URL: https://datasheet.ciiva.com/22664/bc817-16lt1-d-22664204.pdf?src-supplier=Element14; ComponentLink7Description: https://datasheet.ciiva.com/22664/bc817-16lt1-d-22664204.pdf?src-supplier=Element14; ComponentLink8URL: https://datasheet.ciiva.com/22664/1842041-22664101.pdf?src-supplier=Element14; ComponentLink8Description: https://datasheet.ciiva.com/22664/1842041-22664101.pdf?src-supplier=Element14; ComponentLink9URL: https://datasheet.ciiva.com/4722/bc817-16lt1-d-104560-4722229.pdf?src-supplier=Mouser; ComponentLink9Description: https://datasheet.ciiva.com/4722/bc817-16lt1-d-104560-4722229.pdf?src-supplier=Mouser; ComponentLink10URL: https://datasheet.ciiva.com/1195/bc817-16lt1-d-1195763.pdf?src-supplier=Element14; ComponentLink10Description: https://datasheet.ciiva.com/1195/bc817-16lt1-d-1195763.pdf?src-supplier=Element14; ComponentLink11URL: https://datasheet.ciiva.com/1195/bc817-16lt1-d-1195764.pdf?src-supplier=Element14; ComponentLink11Description: https://datasheet.ciiva.com/1195/bc817-16lt1-d-1195764.pdf?src-supplier=Element14; ComponentLink12URL: https://datasheet.ciiva.com/11197/bc817-16lt1-d-11197514.pdf?src-supplier=Avnet; ComponentLink12Description: https://datasheet.ciiva.com/11197/bc817-16lt1-d-11197514.pdf?src-supplier=Avnet; ComponentLink13URL: https://datasheet.ciiva.com/25996/bc817-16lt1-d-25996327.pdf?src-supplier=Avnet+Europe; ComponentLink13Description: https://datasheet.ciiva.com/25996/bc817-16lt1-d-25996327.pdf?src-supplier=Avnet+Europe; ComponentLink14URL: https://datasheet.ciiva.com/976/bc817-16lt1-d-976357.pdf?src-supplier=Digi-Key; ComponentLink14Description: https://datasheet.ciiva.com/976/bc817-16lt1-d-976357.pdf?src-supplier=Digi-Key; ComponentLink15URL: https://datasheet.ciiva.com/976/bc817-16lt1-d-976358.pdf?src-supplier=Digi-Key; ComponentLink15Description: https://datasheet.ciiva.com/976/bc817-16lt1-d-976358.pdf?src-supplier=Digi-Key; ComponentLink16URL: https://datasheet.ciiva.com/976/bc817-16lt1-d-976356.pdf?src-supplier=Digi-Key; ComponentLink16Description: https://datasheet.ciiva.com/976/bc817-16lt1-d-976356.pdf?src-supplier=Digi-Key; Supplier Part Number 1: BC817-25LT1GOSCT-ND
R301-R304 = R60-0805FTN: Res Thin Film 0805 60.4 Ohm 0.1% 1/8W ±25ppm/°C Molded SMD SMD Punched Carrier T/R; Manufacturer 1: Panasonic; Manufacturer Part Number 1: ERA-6AEB60R4V; Resistance: 60.4R; Voltage Rating (DC): 100V; Max Power Dissipation: 125mW; Voltage Rating: 200V; .Creator: DR; Supplier 1: Arrow Electronics; RoHS: Yes; Category: Chip SMD Resistors; Stock 1: 5000; Pricing 1: 1=0,04650, 10=0,03900, 100=0,02860 (USD); Mount: Surface Mount; Case/Package: 0805; Number of Pins: 2; Contact Plating: Tin; Weight: 0.000194oz; Case Code (Metric): 2012; Case Code (Imperial): 0805; Min Operating Temperature: -55°C; Max Operating Temperature: 155°C; Temperature Coefficient: 25ppm/°C; Tolerance: 0.1%; Resistor Type: Thin Film,Metal Film; Features: Automotive AEC-Q200; Package Quantity: 5000; Number of Terminations: 2; Termination: SMD/SMT; Power Rating: 125mW; Packaging: Tape and Reel; Length: 2mm; Width: 1.25mm; Height: 0.5mm; Depth: 1.25mm; Radiation Hardening: No; Lead Free: Lead Free; ComponentLink1URL: https://datasheet.ciiva.com/11811/0900766b80eb1d8c-11811180.pdf?src-supplier=RSComponents; ComponentLink1Description: https://datasheet.ciiva.com/11811/0900766b80eb1d8c-11811180.pdf?src-supplier=RSComponents; ComponentLink2URL: https://datasheet.ciiva.com/41450/001181146-da-01-en-widerstand-era-0805-60r4-0-1-5000st-41450303.pdf?src-supplier=Conrad; ComponentLink2Description: https://datasheet.ciiva.com/41450/001181146-da-01-en-widerstand-era-0805-60r4-0-1-5000st-41450303.pdf?src-supplier=Conrad; ComponentLink3URL: https://datasheet.ciiva.com/5951/485442-5951173.pdf?src-supplier=Farnell; ComponentLink3Description: https://datasheet.ciiva.com/5951/485442-5951173.pdf?src-supplier=Farnell; ComponentLink4URL: https://datasheet.ciiva.com/30184/54aoa0000ce26-30184022.pdf?src-supplier=Onlinecomponents.com; ComponentLink4Description: https://datasheet.ciiva.com/30184/54aoa0000ce26-30184022.pdf?src-supplier=Onlinecomponents.com; ComponentLink5URL: https://datasheet.ciiva.com/9188/aoa0000ce26-9188476.pdf?src-supplier=Avnet; ComponentLink5Description: https://datasheet.ciiva.com/9188/aoa0000ce26-9188476.pdf?src-supplier=Avnet; Supplier Part Number 1: ERA-6AEB60R4V
R305 R308 = R470-0805FTK: Res Thick Film 0805 470 Ohm 1% 1/8W ±100ppm/°C Molded SMD SMD Paper Tape on Plastic Reel; Manufacturer 1: Bourns; Power Rating: 125mW; Voltage Rating: 150V; .Creator: DR; Supplier 1: Arrow Electronics; Manufacturer Part Number 1: CR0805-FX-4700GLF; RoHS: Yes; Category: Chip SMD Resistors; Stock 1: 12623; Pricing 1: 1=0,00990, 10=0,00980, 25=0,00950, 50=0,00940, 100=0,00930, 250=0,00920, 500=0,00910, 1000=0,00890, 3000=0,00870, 6000=0,00860 (USD); Mount: Surface Mount; Case/Package: 0805; Number of Pins: 2; Case Code (Imperial): 0805; Case Code (Metric): 2012; Contact Plating: Tin; Min Operating Temperature: -55°C; Max Operating Temperature: 155°C; Packaging: Tape and Reel; Tolerance: 1%; Resistor Type: Thick Film; Termination: SMD/SMT; Temperature Coefficient: 100ppm/°C; Voltage Rating (DC): 150V; Features: Moisture Resistant; Series: CR0805; Max Power Dissipation: 125mW; Number of Terminations: 2; Resistance Tolerance: 1%; Construction: Rectangular; Technology: THICK FILM; Length: 2mm; Height: 0.5mm; Depth: 1.25mm; Thickness: 508um; Radiation Hardening: No; REACH SVHC: No SVHC; Military Standard: Not; ComponentLink1URL: https://datasheet.ciiva.com/11808/0900766b80fcdb72-11808686.pdf?src-supplier=RSComponents; ComponentLink1Description: https://datasheet.ciiva.com/11808/0900766b80fcdb72-11808686.pdf?src-supplier=RSComponents; ComponentLink2URL: https://datasheet.ciiva.com/7985/1856384-7985880.pdf?src-supplier=Element14; ComponentLink2Description: https://datasheet.ciiva.com/7985/1856384-7985880.pdf?src-supplier=Element14; ComponentLink3URL: https://datasheet.ciiva.com/22693/1902866-22693247.pdf?src-supplier=Element14; ComponentLink3Description: https://datasheet.ciiva.com/22693/1902866-22693247.pdf?src-supplier=Element14; ComponentLink4URL: https://datasheet.ciiva.com/5541/chpreztr-5541930.pdf?src-supplier=Mouser; ComponentLink4Description: https://datasheet.ciiva.com/5541/chpreztr-5541930.pdf?src-supplier=Mouser; Supplier Part Number 1: CR0805-FX-4700GLF
R306 R309 = R47kR-0805FTK
R307 R310 = R22k-0805FTK
TP301-TP308 = TestPoint: Test Point 1x1 mm; .Creator: GP; Category: TestPoint; .PCBcheck: GP; .SCHcheck: GP
U301 U302 = Transceiver CAN MCP2551 I/SN